# Altium project SAMA7_EVK.PrjPcb (part 3 of 5)

## Sheet 08 - ETH1-100.SchDoc
size B; CompanyName: Microchip Technology Inc.; Organization: Microchip Technology; Address1: 2355 West Chandler Blvd.; Address2: Chandler, AZ  85224; Address4: USA; SheetNumber: 9; SheetTotal: 15; SheetTitle: ETH1-100; Time: Time
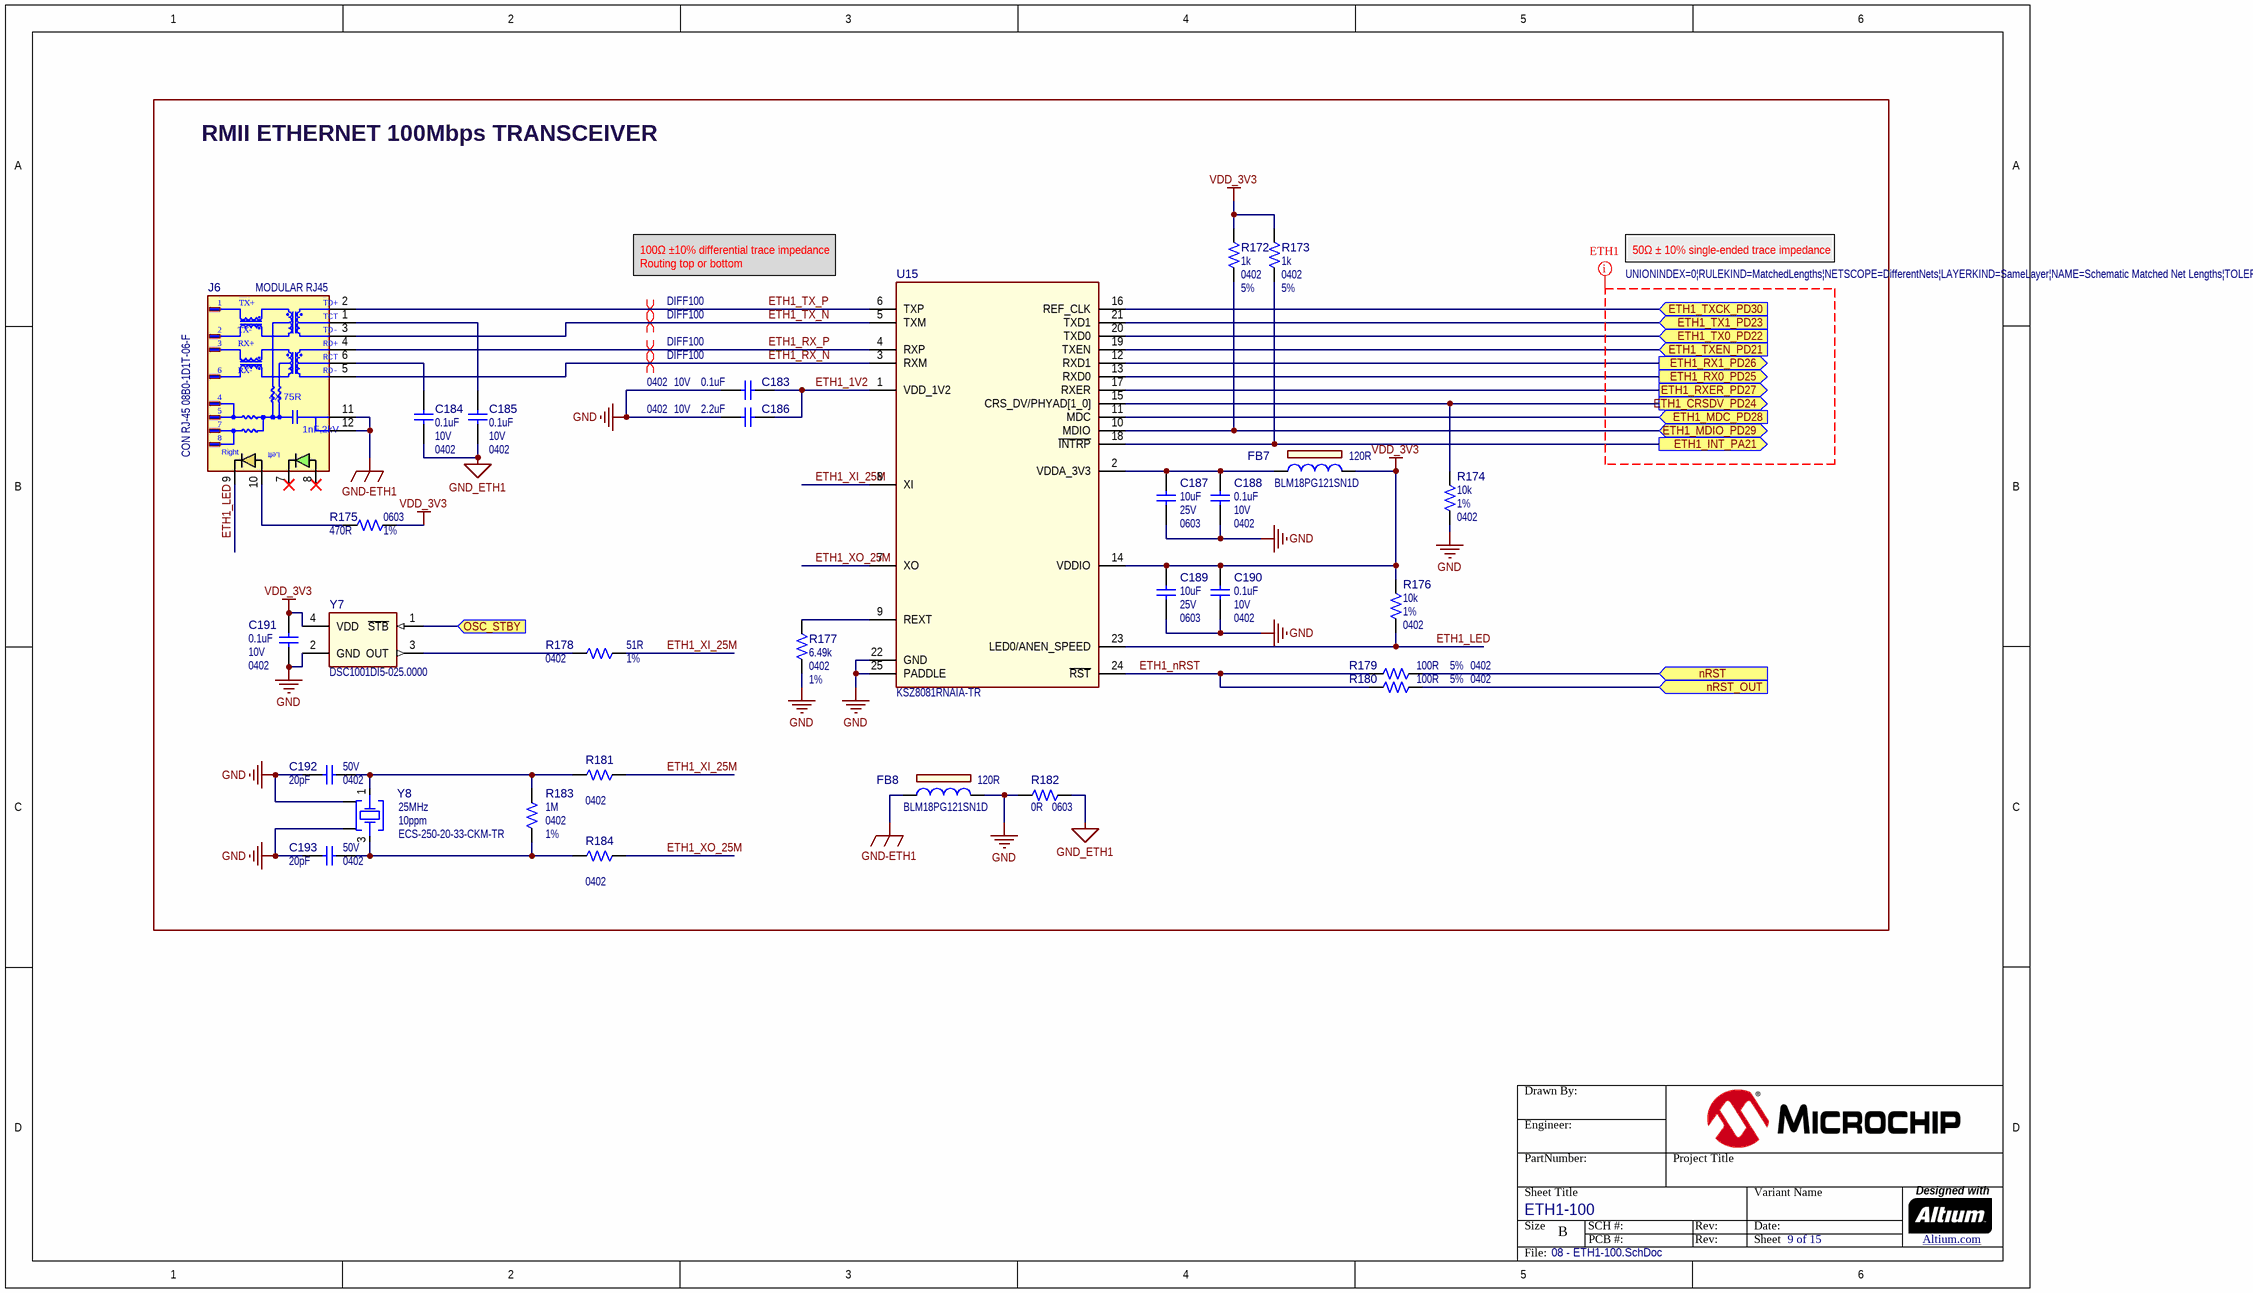
[diagram p4: 08 - ETH1-100.SchDoc]

### Parts
(Parts that share a designator on the sheet are numbered #1, #2 ... from top to bottom, then left to right.)
?#5  (no value)  (graphical)
C183  value 0.1uF  Voltage: 10V  Package: 0402  [CAP_C_0402]  (hidden comment: Capacitor NP)
C184  value 0.1uF  Voltage: 10V  Package: 0402  [CAP_C_0402]  (hidden comment: Capacitor NP)
C185  value 0.1uF  Voltage: 10V  Package: 0402  [CAP_C_0402]  (hidden comment: Capacitor NP)
C186  value 2.2uF  Voltage: 10V  Package: 0402  [CAP_C_0402]  (hidden comment: Capacitor NP)
C187  value 10uF  Voltage: 25V  Package: 0603  [CAP_C_0603]  (hidden comment: Capacitor NP)
C188  value 0.1uF  Voltage: 10V  Package: 0402  [CAP_C_0402]  (hidden comment: Capacitor NP)
C189  value 10uF  Voltage: 25V  Package: 0603  [CAP_C_0603]  (hidden comment: Capacitor NP)
C190  value 0.1uF  Voltage: 10V  Package: 0402  [CAP_C_0402]  (hidden comment: Capacitor NP)
C191  value 0.1uF  Voltage: 10V  Package: 0402  [CAP_C_0402]  (hidden comment: Capacitor NP)
C192  value 20pF  Voltage: 50V  Package: 0402  [CAP_C_0402]  (hidden comment: Capacitor NP)
C193  value 20pF  Voltage: 50V  Package: 0402  [CAP_C_0402]  (hidden comment: Capacitor NP)
FB7  value 120R  Manufacturer Part Number 1: BLM18PG121SN1D  [IND_C_0603]  (hidden comment: Ferrite Bead)
FB8  value 120R  Manufacturer Part Number 1: BLM18PG121SN1D  [IND_C_0603]  (hidden comment: Ferrite Bead)
J6  CON RJ-45 08B0-1D1T-06-F  value MODULAR RJ45  [CON_JACK_RJ45_RA_08B0-1D1T-06-F]
R172  value 1k  Package: 0402  Tolerance: 5%  [RES_C_0402]  (hidden comment: Resistor)
R173  value 1k  Package: 0402  Tolerance: 5%  [RES_C_0402]  (hidden comment: Resistor)
R174  value 10k  Package: 0402  Tolerance: 1%  [RES_C_0402]  (hidden comment: Resistor)
R175  value 470R  Package: 0603  Tolerance: 1%  [RES_C_0603]  (hidden comment: Resistor)
R176  value 10k  Package: 0402  Tolerance: 1%  [RES_C_0402]  (hidden comment: Resistor)
R177  value 6.49k  Package: 0402  Tolerance: 1%  [RES_C_0402]  (hidden comment: Resistor)
R178  value 51R  Package: 0402  Tolerance: 1%  [RES_C_0402]  (hidden comment: Resistor)
R179  value 100R  Package: 0402  Tolerance: 5%  [RES_C_0402]  (hidden comment: Resistor)
R180  value 100R  Package: 0402  Tolerance: 5%  [RES_C_0402]  (hidden comment: Resistor)
R181  Package: 0402  [RES_C_0402]  (hidden comment: Resistor)
R182  value 0R  Package: 0603  [RES_C_0603]  (hidden comment: Resistor)
R183  value 1M  Package: 0402  Tolerance: 1%  [RES_C_0402]  (hidden comment: Resistor)
R184  Package: 0402  [RES_C_0402]  (hidden comment: Resistor)
U15  value KSZ8081RNAIA-TR  [QFN-24_4X4]  (hidden comment: ETHERNET QFN-24)
Y7  Manufacturer Part Number 1: DSC1001DI5-025.0000  [DFN-4_2.5x2]  (hidden comment: DSC10xx DFN-4)
Y8  value 25MHz  Tolerance: 10ppm  Manufacturer Part Number 1: ECS-250-20-33-CKM-TR  [CRYSTAL_L3.2W2.5H0.8]  (hidden comment: Crystal 4 pins 1-3)

### Blocks framed on the sheet
RMII ETHERNET 100Mbps TRANSCEIVER: C183-C193 FB7 FB8 J6 R172-R184 U15 Y7 Y8

### Ports
ETH1_CRSDV_PD24 (out), ETH1_INT_PA21 (out), ETH1_MDC_PD28 (in), ETH1_MDIO_PD29 (bidir), ETH1_RX0_PD25 (out), ETH1_RX1_PD26 (out), ETH1_RXER_PD27 (out), ETH1_TX0_PD22 (in), ETH1_TX1_PD23 (in), ETH1_TXCK_PD30 (in), ETH1_TXEN_PD21 (in), nRST (in), nRST_OUT (in), OSC_STBY (in)

### Nets
GND: C183.1 C186.1 C187.2 C188.1 C189.2 C190.1 C191.1 C192.2 C193.2 FB8.2 R174.1 R177.1 R182.1 U15.22(GND) U15.25(PADDLE) Y7.2(GND) Y8.2 Y8.4
GND-ETH1: FB8.1 J6.11(SHLD) J6.12(SHLD)
GND_ETH1: C184.1 C185.1 R182.2
VDD_3V3: C189.1 C190.2 C191.2 FB7.2 R172.2 R173.2 R175.1 R176.2 U15.14(VDDIO) Y7.4(VDD)
ETH1_1V2: C183.2 C186.2 U15.1(VDD_1V2)
ETH1_LED: J6.9(Ag) R176.1 U15.23(LED0/ANEN_SPEED)
ETH1_nRST: R179.1 R180.1 U15.24(~{RST})
ETH1_RX_N: J6.5(RD-) U15.3(RXM)
ETH1_RX_P: J6.4(RD+) U15.4(RXP)
ETH1_TX_N: J6.3(TD-) U15.5(TXM)
ETH1_TX_P: J6.2(TD+) U15.6(TXP)
ETH1_XI_25M: R178.2 R181.2 U15.8(XI)
ETH1_XO_25M: R184.2 U15.7(XO)
NetC184_2: C184.2 J6.6(RCT)
NetC185_2: C185.2 J6.1(TCT)
NetC187_1: C187.1 C188.2 FB7.1 U15.2(VDDA_3V3)
NetC192_1: C192.1 R181.1 R183.2 Y8.1
NetC193_1: C193.1 R183.1 R184.1 Y8.3
NetJ6_10: J6.10(Cg) R175.2
NetQ3_3: Y7.1(~{STB}) ; port OSC_STBY
NetR4_1: R179.2 ; port nRST
NetR24_1: R180.2 ; port nRST_OUT
NetR172_1: R172.1 U15.10(MDIO) ; port ETH1_MDIO_PD29
NetR173_1: R173.1 U15.18(~{INTRP}) ; port ETH1_INT_PA21
NetR174_2: R174.2 U15.15(CRS_DV/PHYAD[1_0]) ; port ETH1_CRSDV_PD24
NetR177_2: R177.2 U15.9(REXT)
NetR178_1: R178.1 Y7.3(OUT)
NetU15_11: U15.11(MDC) ; port ETH1_MDC_PD28
NetU15_12: U15.12(RXD1) ; port ETH1_RX1_PD26
NetU15_13: U15.13(RXD0) ; port ETH1_RX0_PD25
NetU15_16: U15.16(REF_CLK) ; port ETH1_TXCK_PD30
NetU15_17: U15.17(RXER) ; port ETH1_RXER_PD27
NetU15_19: U15.19(TXEN) ; port ETH1_TXEN_PD21
NetU15_20: U15.20(TXD0) ; port ETH1_TX0_PD22
NetU15_21: U15.21(TXD1) ; port ETH1_TX1_PD23

Not connected (* = marked no-connect by the designer): J6 7(Cy)* 8(Ay)*

### Layout directives
net class ETH1; rule Matched Net Lengths [Tolerance = 0.25mm]: (no net found under the mark)
differential pair; differential pair class DIFF100; net class DIFF100; rule Matched Net Lengths [Tolerance = 4mil]: ETH1_RX_N, ETH1_RX_P, ETH1_TX_N, ETH1_TX_P

### Notes on the sheet
- 100Ω ±10% differential trace impedance
  Routing top or bottom
- 50Ω ± 10% single-ended trace impedance
- Drawn By:
- Engineer:
- PartNumber:
- Project Title
- Sheet Title
- Size
- B
- SCH #:
- PCB #:
- Rev:
- Variant Name
- Date:
- Sheet
- Designed with
- Altium.com <http://go.altium.com/MicrochipLandingPage_Evaluation.html>
- File:
- (in symbol CON1709) TX+; TX-; RX+; RX-; 4X 75R; 1nF,2kV; Left; Right

### Library data of the parts
?#5 = Title Block B
C183-C185 C188 C190 C191 = CAP1238: Capacitor; Manufacturer 1: KEMET; Manufacturer Part Number 1: C0402C104K8RACTU; Description_: CAP CER 0.1uF 10V 10% X7R SMD 0402; Dev Tools Status: Production; Tolerance: 10%; Temperature Coeffcient: X7R; Type: Ceramic; Owner: Tad Ahlvers; Populated: YES; MCHP-ID: CAP1238; Revision: 1; Symbol: Capacitor NP; Status: MCL Design; ComponentLink1URL: https://chn-vm-apps.microchip.com/mchprepo/parts/Datasheets/KEM_C1002_X7R_SMD.pdf; ComponentLink1Description: SVN Datasheet; ComponentLink2URL: C:\ALTIUM_WORK\00001_MCHP-CDB\Datasheets\KEM_C1002_X7R_SMD.pdf; ComponentLink2Description: Local Datasheet; ComponentLink3URL: C:\ALTIUM_WORK\00001_MCHP-CDB\Library\LibraryRefs\Capacitor NP.SchLib; ComponentLink3Description: Open Symbol; ComponentLink4URL: C:\ALTIUM_WORK\00001_MCHP-CDB\Library\Footprints\CAP_C_0402.PcbLib; ComponentLink4Description: Open Footprint; ComponentLink5Description: Open Footprint 2; ComponentLink6Description: Open Footprint 3; ComponentLink7Description: Open Footprint 4; Operating Temperature: -55C to +125C; Category: Capacitor; Manufacturer 2: Samsung; Manufacturer Part Number 2: CL05B104KP5NNNC; Manufacturer 3: Murata Electronics; Manufacturer Part Number 3: GRM155R71A104KA01D; Supplier 1: Digi-Key; Supplier Part Number 1: 399-3520-2-ND; Supplier 2: Digi-Key; Supplier Part Number 2: 1276-1002-2-ND; Supplier 3: Mouser; Supplier Part Number 3: 81-GRM155R71A104KA1D; Quantity Override: 1
C186 = CAP1468: Capacitor; Manufacturer 1: TDK Corporation; Manufacturer Part Number 1: C1005X7S1A225K050BC; Description_: CAP CER 2.2uF 10V 10% X7S SMD 0402; Dev Tools Status: Production; Tolerance: 10%; Temperature Coeffcient: X7S; Type: Ceramic; Owner: Sorin Stanoaia; Populated: YES; MCHP-ID: CAP1468; Revision: 1; Symbol: Capacitor NP; Status: MCL Design; ComponentLink1URL: https://chn-vm-apps.microchip.com/mchprepo/parts/Datasheets/c02e.pdf; ComponentLink1Description: SVN Datasheet; ComponentLink2URL: C:\ALTIUM_WORK\00001_MCHP-CDB\Datasheets\c02e.pdf; ComponentLink2Description: Local Datasheet; ComponentLink3URL: C:\ALTIUM_WORK\00001_MCHP-CDB\Library\LibraryRefs\Capacitor NP.SchLib; ComponentLink3Description: Open Symbol; ComponentLink4URL: C:\ALTIUM_WORK\00001_MCHP-CDB\Library\Footprints\CAP_C_0402.PcbLib; ComponentLink4Description: Open Footprint; ComponentLink5Description: Open Footprint 2; ComponentLink6Description: Open Footprint 3; ComponentLink7Description: Open Footprint 4; Operating Temperature: -55C to +125C; Category: Capacitor; Manufacturer 2: Murata Electronics North America; Manufacturer Part Number 2: GRM155C71A225KE11J; Supplier 1: Digi-Key; Supplier Part Number 1: 445-9097-1-ND; Supplier 2: Digi-Key; Supplier Part Number 2: GRM155C71A225KE11J-ND; Quantity Override: 1
C187 C189 = CAP1650: Capacitor; Manufacturer 1: TDK Corporation; Manufacturer Part Number 1: C1608X5R1E106M080AC; Description_: CAP CER 10uF 25V 20% X5R SMD 0603; Dev Tools Status: Production; Tolerance: 20%; Temperature Coeffcient: X5R; Type: Ceramic; Populated: YES; Owner: Razvan Cristescu; MCHP-ID: CAP1650; Revision: 1; Symbol: Capacitor NP; Status: MCL Design; ComponentLink1URL: https://chn-vm-apps.microchip.com/mchprepo/parts/Datasheets/1913358.pdf; ComponentLink1Description: SVN Datasheet; ComponentLink2URL: C:\ALTIUM_WORK\00001_MCHP-CDB\Datasheets\1913358.pdf; ComponentLink2Description: Local Datasheet; ComponentLink3URL: C:\ALTIUM_WORK\00001_MCHP-CDB\Library\LibraryRefs\Capacitor NP.SchLib; ComponentLink3Description: Open Symbol; ComponentLink4URL: C:\ALTIUM_WORK\00001_MCHP-CDB\Library\Footprints\CAP_C_0603.PcbLib; ComponentLink4Description: Open Footprint; ComponentLink5Description: Open Footprint 2; ComponentLink6Description: Open Footprint 3; ComponentLink7Description: Open Footprint 4; Operating Temperature: -55C to +85C; Category: Capacitor; Supplier 1: Farnell; Supplier Part Number 1: 2521968; Quantity Override: 1
C192 C193 = CAP2438: Manufacturer 1: Samsung Electro-Mechanics; Manufacturer Part Number 1: CL05C200GB51PNC; Description_: Ceramic capacitor, SMD 0402, 20pF, C0G, 50V, +/-2%; Dev Tools Status: Design; Tolerance: 2%; Temperature Coeffcient: C0G; Type: Ceramic; Populated: DNP; Owner: Dragos Danaila; MCHP-ID: CAP2438; Revision: 1; Symbol: Capacitor NP; Status: MCL Design; ComponentLink1Description: SVN Datasheet; ComponentLink2Description: Local Datasheet; ComponentLink3URL: C:\ALTIUM_WORK\00001_MCHP-CDB\Library\LibraryRefs\Capacitor NP.SchLib; ComponentLink3Description: Open Symbol; ComponentLink4URL: C:\ALTIUM_WORK\00001_MCHP-CDB\Library\Footprints\CAP_C_0402.PcbLib; ComponentLink4Description: Open Footprint; ComponentLink5Description: Open Footprint 2; ComponentLink6Description: Open Footprint 3; ComponentLink7Description: Open Footprint 4; Operating Temperature: -55C to +125C; Category: Capacitor; Supplier 1: Digikey; Supplier Part Number 1: 1276-CL05C200GB51PNCTR-ND; Quantity Override: 1
FB7 FB8 = IND1009: Manufacturer 1: Murata; Description_: FERRITE 120R@100MHz 2A SMD 0603; Dev Tools Status: Production; Owner: Petnarong Chaijaroong; DCR: 0.05R; Saturation Current: 12A; Populated: Yes; MCHP-ID: IND1009; Revision: 0; Symbol: Ferrite Bead; Status: MCL Design; ComponentLink1URL: https://chn-vm-apps.microchip.com/mchprepo/parts/Datasheets/L0110S0100BLM18P.pdf; ComponentLink1Description: SVN Datasheet; ComponentLink2URL: C:\ALTIUM_WORK\00001_MCHP-CDB\Datasheets\L0110S0100BLM18P.pdf; ComponentLink2Description: Local Datasheet; ComponentLink3URL: C:\ALTIUM_WORK\00001_MCHP-CDB\Library\LibraryRefs\Ferrite Bead.SchLib; ComponentLink3Description: Open Symbol; ComponentLink4URL: C:\ALTIUM_WORK\00001_MCHP-CDB\Library\Footprints\IND_C_0603.PcbLib; ComponentLink4Description: Open Footprint; ComponentLink5Description: Open Footprint 2; ComponentLink6Description: Open Footprint 3; ComponentLink7Description: Open Footprint 4; Operating Temperature: -55C to +125C; Package: 0603; Type: Ferrite Bead; Category: Inductor; Supplier 1: Digi-Key; Supplier Part Number 1: 490-1037-1-ND; Quantity Override: 1
J6 = CON1709: 100 Base-TX (Fast Ethernet), RJ45 1x1 Tab-UP with LEDs(g/y), integrated magnetics connector; Manufacturer 1: Bel Fuse Inc.; Description_: CON MODULAR JACK RJ45 10/100 MAGNETICS 2xLEDs SHIELD TH R/A; Dev Tools Status: Design; Owner: Ilie Galan; Populated: YES; MCHP-ID: CON1709; Revision: A; Symbol: CON RJ-45 08B0-1D1T-06-F; Status: MCL Design; ComponentLink1URL: https://chn-vm-apps.microchip.com/mchprepo/parts/Datasheets/08B0-1D1T-06-F.pdf; ComponentLink1Description: SVN Datasheet; ComponentLink2URL: C:\ALTIUM_WORK\00001_MCHP-CDB\Datasheets\08B0-1D1T-06-F.pdf; ComponentLink2Description: Local Datasheet; ComponentLink3URL: C:\ALTIUM_WORK\00001_MCHP-CDB\Library\LibraryRefs\CON RJ-45 08B0-1D1T-06-F.SchLib; ComponentLink3Description: Open Symbol; ComponentLink4URL: C:\ALTIUM_WORK\00001_MCHP-CDB\Library\Footprints\CON_JACK_RJ45_RA_08B0-1D1T-06-F.PcbLib; ComponentLink4Description: Open Footprint; ComponentLink5Description: Open Footprint 2; ComponentLink6Description: Open Footprint 3; ComponentLink7Description: Open Footprint 4; Type: Modular; Category: Connector; Manufacturer Part Number 1: 08B0-1D1T-06-F; Supplier 1: Digi-Key; Supplier Part Number 1: 507-1441-ND; Quantity Override: 1
R172 R173 = RSMT0316: Manufacturer 1: Panasonic; Manufacturer Part Number 1: ERJ-2GEJ102X; Description_: RES TKF 1k 5% 1/16W SMD 0402; Dev Tools Status: Production; Voltage: 50V; Temperature Coeffcient: 200ppm/C; Power: 1/16W; Owner: Tad Ahlvers; Populated: YES; MCHP-ID: RSMT0316; Revision: 1; Symbol: Resistor; Status: MCL Design; ComponentLink1URL: https://chn-vm-apps.microchip.com/mchprepo/parts/Datasheets/AOA0000CE1.pdf; ComponentLink1Description: SVN Datasheet; ComponentLink2URL: C:\ALTIUM_WORK\00001_MCHP-CDB\Datasheets\AOA0000CE1.pdf; ComponentLink2Description: Local Datasheet; ComponentLink3URL: C:\ALTIUM_WORK\00001_MCHP-CDB\Library\LibraryRefs\Resistor.SchLib; ComponentLink3Description: Open Symbol; ComponentLink4URL: C:\ALTIUM_WORK\00001_MCHP-CDB\Library\Footprints\RES_C_0402.PcbLib; ComponentLink4Description: Open Footprint; ComponentLink5Description: Open Footprint 2; ComponentLink6Description: Open Footprint 3; ComponentLink7Description: Open Footprint 4; Operating Temperature: -55C to +155C; Category: Resistor; Type: RES SMD; Composition: TKF; Supplier 1: Digi-Key; Supplier Part Number 1: P1.0KJCT-ND; Quantity Override: 1
R174 R176 = RSMT1019: Manufacturer 1: Panasonic; Manufacturer Part Number 1: ERJ-2RKF1002X; Description_: RES TKF 10k 1% 1/10W SMD 0402; Dev Tools Status: Production; Voltage: 50V; Temperature Coeffcient: 100ppm/C; Power: 1/10W; Owner: Brent Lanphear; Populated: Yes; MCHP-ID: RSMT1019; Revision: 2; Symbol: Resistor; Status: MCL Design; ComponentLink1URL: https://chn-vm-apps.microchip.com/mchprepo/parts/Datasheets/AOA0000CE2.pdf; ComponentLink1Description: SVN Datasheet; ComponentLink2URL: C:\ALTIUM_WORK\00001_MCHP-CDB\Datasheets\AOA0000CE2.pdf; ComponentLink2Description: Local Datasheet; ComponentLink3URL: C:\ALTIUM_WORK\00001_MCHP-CDB\Library\LibraryRefs\Resistor.SchLib; ComponentLink3Description: Open Symbol; ComponentLink4URL: C:\ALTIUM_WORK\00001_MCHP-CDB\Library\Footprints\RES_C_0402.PcbLib; ComponentLink4Description: Open Footprint; ComponentLink5Description: Open Footprint 2; ComponentLink6Description: Open Footprint 3; ComponentLink7Description: Open Footprint 4; Operating Temperature: -55C to +155C; Category: Resistor; Type: RES SMD; Composition: TKF; Supplier 1: Digi-Key; Supplier Part Number 1: P10.0KLCT-ND; Quantity Override: 1
R175 = RSMT0518: Manufacturer 1: Panasonic; Manufacturer Part Number 1: ERJ-3EKF4700V; Description_: RES TKF 470R 1% 1/10W SMD 0603; Dev Tools Status: Production; Voltage: 50V; Temperature Coeffcient: 100ppm/C; Power: 1/10W; Populated: Yes; MCHP-ID: RSMT0518; Revision: 1; Symbol: Resistor; Status: MCL Design; ComponentLink1URL: https://chn-vm-apps.microchip.com/mchprepo/parts/Datasheets/PYu-RC0603_51_RoHS_L_4.pdf; ComponentLink1Description: SVN Datasheet; ComponentLink2URL: C:\ALTIUM_WORK\00001_MCHP-CDB\Datasheets\PYu-RC0603_51_RoHS_L_4.pdf; ComponentLink2Description: Local Datasheet; ComponentLink3URL: C:\ALTIUM_WORK\00001_MCHP-CDB\Library\LibraryRefs\Resistor.SchLib; ComponentLink3Description: Open Symbol; ComponentLink4URL: C:\ALTIUM_WORK\00001_MCHP-CDB\Library\Footprints\RES_C_0603.PcbLib; ComponentLink4Description: Open Footprint; ComponentLink5Description: Open Footprint 2; ComponentLink6Description: Open Footprint 3; ComponentLink7Description: Open Footprint 4; Operating Temperature: -55C to +155C; Category: Resistor; Type: RES SMD; Composition: TKF; Manufacturer 2: Stackpole Electronics Inc; Manufacturer Part Number 2: RMCF0603FT470R; Manufacturer 3: Yageo; Manufacturer Part Number 3: RC0603FR-07470RL; Supplier 1: Digi-Key; Supplier Part Number 1: P470HCT-ND; Supplier 2: Digi-Key; Supplier Part Number 2: RMCF1/16470FRTR-ND; Supplier 3: Digi-Key; Supplier Part Number 3: 311-470HRCT-ND; Quantity Override: 1
R177 = RSMT1297: Manufacturer 1: Bourns Inc.; Manufacturer Part Number 1: CR0402-FX-6491GLF; Description_: RES TKF 6.49k 1% 1/16W SMD 0402; Dev Tools Status: Design; Voltage: 50V; Temperature Coeffcient: 100ppm/C; Power: 1/16W; Owner: Dragos Danaila; Populated: YES; MCHP-ID: RSMT1297; Revision: 1; Symbol: Resistor; Status: MCL Design; ComponentLink1URL: https://chn-vm-apps.microchip.com/mchprepo/parts/Datasheets/crxxxxx.pdf; ComponentLink1Description: SVN Datasheet; ComponentLink2URL: C:\ALTIUM_WORK\00001_MCHP-CDB\Datasheets\crxxxxx.pdf; ComponentLink2Description: Local Datasheet; ComponentLink3URL: C:\ALTIUM_WORK\00001_MCHP-CDB\Library\LibraryRefs\Resistor.SchLib; ComponentLink3Description: Open Symbol; ComponentLink4URL: C:\ALTIUM_WORK\00001_MCHP-CDB\Library\Footprints\RES_C_0402.PcbLib; ComponentLink4Description: Open Footprint; ComponentLink5Description: Open Footprint 2; ComponentLink6Description: Open Footprint 3; ComponentLink7Description: Open Footprint 4; Operating Temperature: -55C to +155C; Category: Resistor; Type: RES SMD; Composition: TKF; Supplier 1: Digikey; Supplier Part Number 1: CR0402-FX-6491GLFCT-ND; Quantity Override: 1
R178 = RSMT1294: Manufacturer 1: Panasonic Electronic Components; Manufacturer Part Number 1: ERJ-PA2F51R0X; Description_: RES TKF 51R 1% 1/5W SMD 0402; Dev Tools Status: Design; Voltage: 50V; Temperature Coeffcient: 100ppm/C; Power: 1/5W; Owner: Dragos Danaila; Populated: YES; MCHP-ID: RSMT1294; Revision: 1; Symbol: Resistor; Status: MCL Design; ComponentLink1URL: https://chn-vm-apps.microchip.com/mchprepo/parts/Datasheets/AOA0000C331.pdf; ComponentLink1Description: SVN Datasheet; ComponentLink2URL: C:\ALTIUM_WORK\00001_MCHP-CDB\Datasheets\AOA0000C331.pdf; ComponentLink2Description: Local Datasheet; ComponentLink3URL: C:\ALTIUM_WORK\00001_MCHP-CDB\Library\LibraryRefs\Resistor.SchLib; ComponentLink3Description: Open Symbol; ComponentLink4URL: C:\ALTIUM_WORK\00001_MCHP-CDB\Library\Footprints\RES_C_0402.PcbLib; ComponentLink4Description: Open Footprint; ComponentLink5Description: Open Footprint 2; ComponentLink6Description: Open Footprint 3; ComponentLink7Description: Open Footprint 4; Operating Temperature: -55C to +155C; Category: Resistor; Type: RES SMD; Composition: TKF; Supplier 1: Digikey; Supplier Part Number 1: P124491CT-ND; Quantity Override: 1
R179 = RES2692: Manufacturer 1: Bourns Inc.; Manufacturer Part Number 1: CR0402AJW-101GAS; Description_: RES TKF 100R 5% 1/10W SMD 0402; Dev Tools Status: Design; Voltage: 50V; Temperature Coeffcient: 200ppm/C; Power: 1/16W; Owner: Dragos Danaila; Populated: DNP; MCHP-ID: RES2692; Revision: 1; Symbol: Resistor; Status: MCL Design; ComponentLink1URL: https://chn-vm-apps.microchip.com/mchprepo/parts/Datasheets/crxxxxa-as.pdf; ComponentLink1Description: SVN Datasheet; ComponentLink2URL: C:\ALTIUM_WORK\00001_MCHP-CDB\Datasheets\crxxxxa-as.pdf; ComponentLink2Description: Local Datasheet; ComponentLink3URL: C:\ALTIUM_WORK\00001_MCHP-CDB\Library\LibraryRefs\Resistor.SchLib; ComponentLink3Description: Open Symbol; ComponentLink4URL: C:\ALTIUM_WORK\00001_MCHP-CDB\Library\Footprints\RES_C_0402.PcbLib; ComponentLink4Description: Open Footprint; ComponentLink5Description: Open Footprint 2; ComponentLink6Description: Open Footprint 3; ComponentLink7Description: Open Footprint 4; Operating Temperature: -55C to +155C; Category: Resistor; Type: RES SMD; Composition: TKF; Supplier 1: Digikey; Supplier Part Number 1: CR0402AJW-101GASTR-ND; Quantity Override: 1
R180 = RES2692: Manufacturer 1: Bourns Inc.; Manufacturer Part Number 1: CR0402AJW-101GAS; Description_: RES TKF 100R 5% 1/10W SMD 0402; Dev Tools Status: Design; Voltage: 50V; Temperature Coeffcient: 200ppm/C; Power: 1/16W; Owner: Dragos Danaila; Populated: YES; MCHP-ID: RES2692; Revision: 1; Symbol: Resistor; Status: MCL Design; ComponentLink1URL: https://chn-vm-apps.microchip.com/mchprepo/parts/Datasheets/crxxxxa-as.pdf; ComponentLink1Description: SVN Datasheet; ComponentLink2URL: C:\ALTIUM_WORK\00001_MCHP-CDB\Datasheets\crxxxxa-as.pdf; ComponentLink2Description: Local Datasheet; ComponentLink3URL: C:\ALTIUM_WORK\00001_MCHP-CDB\Library\LibraryRefs\Resistor.SchLib; ComponentLink3Description: Open Symbol; ComponentLink4URL: C:\ALTIUM_WORK\00001_MCHP-CDB\Library\Footprints\RES_C_0402.PcbLib; ComponentLink4Description: Open Footprint; ComponentLink5Description: Open Footprint 2; ComponentLink6Description: Open Footprint 3; ComponentLink7Description: Open Footprint 4; Operating Temperature: -55C to +155C; Category: Resistor; Type: RES SMD; Composition: TKF; Supplier 1: Digikey; Supplier Part Number 1: CR0402AJW-101GASTR-ND; Quantity Override: 1
R181 R184 = RES2693: Manufacturer 1: Bourns Inc.; Manufacturer Part Number 1: CR0402-J/-000GLF; Description_: RES TKF 0R 1/16W SMD 0402; Dev Tools Status: Design; Power: 1/16W; Populated: DNP; Owner: Dragos Danaila; Voltage: 50V; Temperature Coeffcient: 100ppm/C; Current: 1A; MCHP-ID: RES2693; Revision: 1; Symbol: Resistor; Status: MCL Design; ComponentLink1URL: https://chn-vm-apps.microchip.com/mchprepo/parts/Datasheets/crxxxxx.pdf; ComponentLink1Description: SVN Datasheet; ComponentLink2URL: C:\ALTIUM_WORK\00001_MCHP-CDB\Datasheets\crxxxxx.pdf; ComponentLink2Description: Local Datasheet; ComponentLink3URL: C:\ALTIUM_WORK\00001_MCHP-CDB\Library\LibraryRefs\Resistor.SchLib; ComponentLink3Description: Open Symbol; ComponentLink4URL: C:\ALTIUM_WORK\00001_MCHP-CDB\Library\Footprints\RES_C_0402.PcbLib; ComponentLink4Description: Open Footprint; ComponentLink5Description: Open Footprint 2; ComponentLink6Description: Open Footprint 3; ComponentLink7Description: Open Footprint 4; Operating Temperature: -55C to +155C; Category: Resistor; Type: RES SMD; Composition: TKF; Supplier 1: Digikey; Supplier Part Number 1: CR0402-J/-000GLFTR-ND; Quantity Override: 1
R182 = RSMT0001: Manufacturer 1: Panasonic; Manufacturer Part Number 1: ERJ-3GSY0R00V; Description_: RES TKF 0R 1/10W SMD 0603; Dev Tools Status: Production; Power: 1/10W; Populated: Yes; MCHP-ID: RSMT0001; Revision: 2; Symbol: Resistor; Status: MCL Design; ComponentLink1URL: https://chn-vm-apps.microchip.com/mchprepo/parts/Datasheets/nrc.pdf; ComponentLink1Description: SVN Datasheet; ComponentLink2URL: C:\ALTIUM_WORK\00001_MCHP-CDB\Datasheets\nrc.pdf; ComponentLink2Description: Local Datasheet; ComponentLink3URL: C:\ALTIUM_WORK\00001_MCHP-CDB\Library\LibraryRefs\Resistor.SchLib; ComponentLink3Description: Open Symbol; ComponentLink4URL: C:\ALTIUM_WORK\00001_MCHP-CDB\Library\Footprints\RES_C_0603.PcbLib; ComponentLink4Description: Open Footprint; ComponentLink5Description: Open Footprint 2; ComponentLink6Description: Open Footprint 3; ComponentLink7Description: Open Footprint 4; Operating Temperature: -55C to +155C; Category: Resistor; Type: RES SMD; Composition: TKF; Manufacturer 2: Panasonic; Manufacturer Part Number 2: ERJ-3GEY0R00V; Manufacturer 3: ROHM; Manufacturer Part Number 3: MCR03EZPJ000; Manufacturer 4: Stackpole Electronics Inc; Manufacturer Part Number 4: RMCF0603ZT0R00; Manufacturer 5: Stackpole Electronics Inc; Manufacturer Part Number 5: RMCF 1/16 0 R; Manufacturer 6: Vishay; Manufacturer Part Number 6: CRCW06030000Z0EA; Manufacturer 7: Yageo; Manufacturer Part Number 7: RC0603JR-070RL; Manufacturer 8: KOA Speer; Manufacturer Part Number 8: RK73Z1JTTP; Manufacturer 9: NIC Components; Manufacturer Part Number 9: NRC06Z0TRF; Supplier 1: Digi-Key; Supplier Part Number 1: P0.0GTR-ND; Supplier 2: Digi-Key; Supplier Part Number 2: RHM0.0GCT-ND; Supplier 3: Digi-Key; Supplier Part Number 3: RMCF0603ZT0R00TR-ND; Supplier 4: Digi-Key; Supplier Part Number 4: RMCF0603ZT0R00CT-ND; Supplier 5: Digi-Key; Supplier Part Number 5: RMCF1/160RTR-ND; Supplier 6: Digi-Key; Supplier Part Number 6: 541-0.0GCT-ND; Supplier 7: Digi-Key; Supplier Part Number 7: 311-0.0GRCT-ND; Supplier 8: KOA Speer; Supplier Part Number 8: RK73Z1JTTP; Supplier 9: NIC Components; Supplier Part Number 9: NRC06Z0TRF; Quantity Override: 1
R183 = RSMT1017: Manufacturer 1: Panasonic; Manufacturer Part Number 1: ERJ-2RKF1004X; Description_: RES TKF 1M 1% 1/10W SMD 0402; Dev Tools Status: Production; Voltage: 50V; Temperature Coeffcient: 100ppm/C; Power: 1/10W; Owner: Brent Lanphear; Populated: DNP; MCHP-ID: RSMT1017; Revision: 2; Symbol: Resistor; Status: MCL Design; ComponentLink1URL: https://chn-vm-apps.microchip.com/mchprepo/parts/Datasheets/AOA0000CE2.pdf; ComponentLink1Description: SVN Datasheet; ComponentLink2URL: C:\ALTIUM_WORK\00001_MCHP-CDB\Datasheets\AOA0000CE2.pdf; ComponentLink2Description: Local Datasheet; ComponentLink3URL: C:\ALTIUM_WORK\00001_MCHP-CDB\Library\LibraryRefs\Resistor.SchLib; ComponentLink3Description: Open Symbol; ComponentLink4URL: C:\ALTIUM_WORK\00001_MCHP-CDB\Library\Footprints\RES_C_0402.PcbLib; ComponentLink4Description: Open Footprint; ComponentLink5Description: Open Footprint 2; ComponentLink6Description: Open Footprint 3; ComponentLink7Description: Open Footprint 4; Operating Temperature: -55C to +155C; Category: Resistor; Type: RES SMD; Composition: TKF; Supplier 1: Digi-Key; Supplier Part Number 1: P1.00MLCT-ND; Quantity Override: 1
U15 = MIC7404: Manufacturer 1: Microchip Technology; Description_: MCHP INTERFACE ETHERNET KSZ8081RNAIA-TR QFN-24; Dev Tools Status: Design; Owner: Ciprian Abramov; Populated: YES; MCHP-ID: MIC7404; Symbol: KSZ8081RNAIA QFN-24; Type: Ethernet; Status: MCL Design; Revision: A; Category: MCHP-Interface; ComponentLink1Description: SVN Datasheet; ComponentLink2Description: Local Datasheet; ComponentLink3URL: C:\ALTIUM_WORK\00001_MCHP-CDB\Library\LibraryRefs\KSZ8081RNAIA QFN-24.SchLib; ComponentLink3Description: Open Symbol; ComponentLink4URL: C:\ALTIUM_WORK\00001_MCHP-CDB\Library\Footprints\QFN-24_4X4.PcbLib; ComponentLink4Description: Open Footprint; ComponentLink5Description: Open Footprint 2; ComponentLink6Description: Open Footprint 3; ComponentLink7Description: Open Footprint 4; Manufacturer Part Number 1: KSZ8081RNAIA-TR; Supplier 1: Digi-Key; Supplier Part Number 1: 576-4174-1-ND; Quantity Override: 1
Y7 = MIC8282: Manufacturer 1: Microchip Technology; Description_: MCHP CLOCK OSCILLATOR SINGLE 25MHz DSC1001DI5-025.0000 DFN-4; Dev Tools Status: Design; Value: 25MHz; Owner: Ciprian Abramov; Populated: YES; MCHP-ID: MIC8282; Revision: A; Symbol: DSC10xx DFN-4; Status: MCL Design; ComponentLink1Description: SVN Datasheet; ComponentLink2Description: Local Datasheet; ComponentLink3URL: C:\ALTIUM_WORK\00001_MCHP-CDB\Library\LibraryRefs\DSC10xx DFN-4.SchLib; ComponentLink3Description: Open Symbol; ComponentLink4URL: C:\ALTIUM_WORK\00001_MCHP-CDB\Library\Footprints\DFN-4_2.5x2.PcbLib; ComponentLink4Description: Open Footprint; ComponentLink5Description: Open Footprint 2; ComponentLink6Description: Open Footprint 3; ComponentLink7Description: Open Footprint 4; Category: MCHP-Clock/Timing; Type: Oscillator; Supplier 1: Digi-Key; Supplier Part Number 1: 576-4982-5-ND; Quantity Override: 1
Y8 = OSC1159: Crystal; Manufacturer 1: ECS Inc.; Description_: CRYSTAL 25MHz 20pF SMD L3.2W2.5H0.8; Dev Tools Status: Design; Owner: Ciprian Abramov; Load Capacitance: 20pF; Populated: DNP; MCHP-ID: OSC1159; Revision: A; Symbol: Crystal 4 pins 1-3; Status: MCL Design; ComponentLink1URL: https://chn-vm-apps.microchip.com/mchprepo/parts/Datasheets/ecx-32.pdf; ComponentLink1Description: SVN Datasheet; ComponentLink2URL: C:\ALTIUM_WORK\00001_MCHP-CDB\Datasheets\ecx-32.pdf; ComponentLink2Description: Local Datasheet; ComponentLink3URL: C:\ALTIUM_WORK\00001_MCHP-CDB\Library\LibraryRefs\Crystal 4 pins 1-3.SchLib; ComponentLink3Description: Open Symbol; ComponentLink4URL: C:\ALTIUM_WORK\00001_MCHP-CDB\Library\Footprints\CRYSTAL_L3.2W2.5H0.8.PcbLib; ComponentLink4Description: Open Footprint; ComponentLink5Description: Open Footprint 2; ComponentLink6Description: Open Footprint 3; ComponentLink7Description: Open Footprint 4; Operating Temperature: -20C to +70C; Package: L3.2W2.5H0.8; Type: Crystal; Category: Crystal/Oscillator; Supplier 1: Digi-Key; Supplier Part Number 1: XC1817CT-ND; Quantity Override: 1

## Sheet 10 - Expansion Connectors.SchDoc
size B; CompanyName: Microchip Technology Inc.; Organization: Microchip Technology; Address1: 2355 West Chandler Blvd.; Address2: Chandler, AZ  85224; Address4: USA; SheetNumber: 11; SheetTotal: 15; SheetTitle: Expansion Connectors; Time: Time
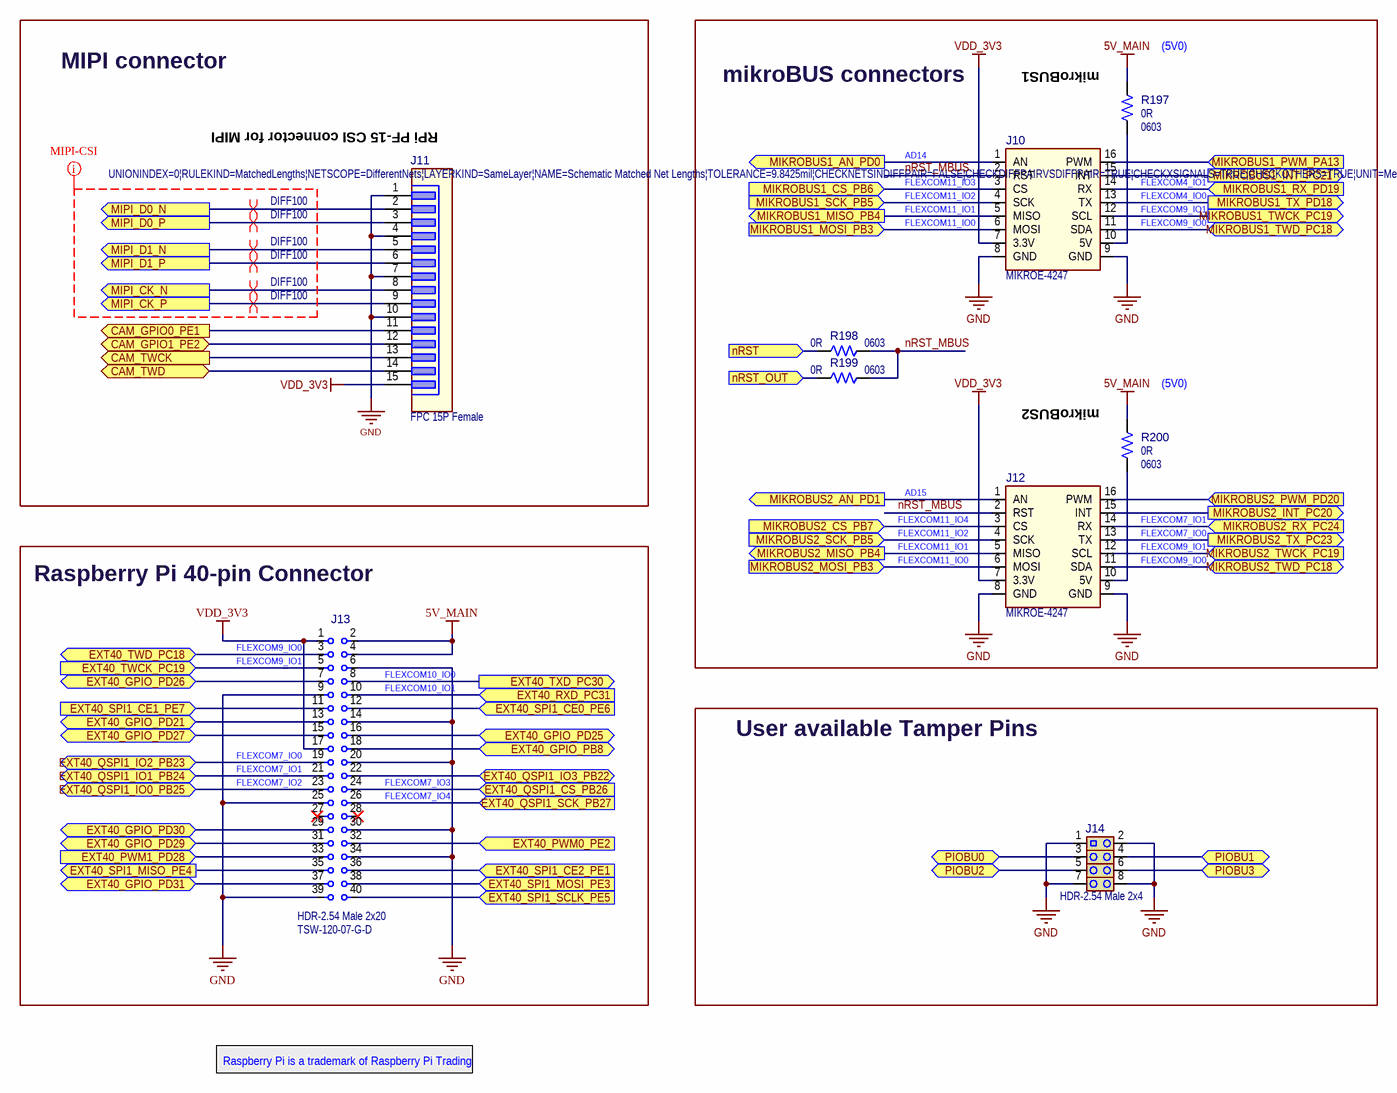
[diagram p5: 10 - Expansion Connectors.SchDoc]

### Parts
(Parts that share a designator on the sheet are numbered #1, #2 ... from top to bottom, then left to right.)
?#6  (no value)  (graphical)
J10  value MIKROE-4247  [SOCKET_mikroBUS_F_2.54_2x8_V_25.4x21_original]  (hidden comment: SOCKET mikroBUS HOST)
J11  value FPC 15P Female  [CON_FPC_1_FEMALE_1X15_SMD_TE_1-1734248-5]  (hidden comment: CON FPC 15pos)
J12  value MIKROE-4247  [SOCKET_mikroBUS_F_2.54_2x8_V_25.4x21_original]  (hidden comment: SOCKET mikroBUS HOST)
J13  value HDR-2.54 Male 2x20  Manufacturer Part Number 1: TSW-120-07-G-D  [HDR_M_2.54_2x20]  (hidden comment: Header 2x20)
J14  value HDR-2.54 Male 2x4  [HDR_M_2.54_2x4_SMD]  (hidden comment: Header 2x4)
R197  value 0R  Package: 0603  [RES_C_0603]  (hidden comment: Resistor)
R198  value 0R  Package: 0603  [RES_C_0603]  (hidden comment: Resistor)
R199  value 0R  Package: 0603  [RES_C_0603]  (hidden comment: Resistor)
R200  value 0R  Package: 0603  [RES_C_0603]  (hidden comment: Resistor)

### Blocks framed on the sheet
MIPI connector: J11
mikroBUS connectors: J10 J12 R197-R200
Raspberry Pi 40-pin Connector: J13
User available Tamper Pins: J14

### Ports
CAM_GPIO0_PE1 (out), CAM_GPIO1_PE2 (bidir), CAM_TWCK (out), CAM_TWD (bidir), EXT40_GPIO_PB8 (bidir), EXT40_GPIO_PD21 (bidir), EXT40_GPIO_PD25 (bidir), EXT40_GPIO_PD26 (bidir), EXT40_GPIO_PD27 (bidir), EXT40_GPIO_PD29 (bidir), EXT40_GPIO_PD30 (bidir), EXT40_GPIO_PD31 (bidir), EXT40_PWM0_PE2 (in), EXT40_PWM1_PD28 (in), EXT40_QSPI1_CS_PB26 (in), EXT40_QSPI1_IO0_PB25 (bidir), EXT40_QSPI1_IO1_PB24 (bidir), EXT40_QSPI1_IO2_PB23 (bidir), EXT40_QSPI1_IO3_PB22 (bidir), EXT40_QSPI1_SCK_PB27 (in), EXT40_RXD_PC31 (in), EXT40_SPI1_CE0_PE6 (in), EXT40_SPI1_CE1_PE7 (in), EXT40_SPI1_CE2_PE1 (in), EXT40_SPI1_MISO_PE4 (out), EXT40_SPI1_MOSI_PE3 (in), EXT40_SPI1_SCLK_PE5 (in), EXT40_TWCK_PC19 (in), EXT40_TWD_PC18 (bidir), EXT40_TXD_PC30 (out), MIKROBUS1_AN_PD0 (out), MIKROBUS1_CS_PB6 (in), MIKROBUS1_INT_PC21 (out), MIKROBUS1_MISO_PB4 (out), MIKROBUS1_MOSI_PB3 (in), MIKROBUS1_PWM_PA13 (in), MIKROBUS1_RX_PD19 (in), MIKROBUS1_SCK_PB5 (in), MIKROBUS1_TWCK_PC19 (out), MIKROBUS1_TWD_PC18 (bidir), MIKROBUS1_TX_PD18 (out), MIKROBUS2_AN_PD1 (out), MIKROBUS2_CS_PB7 (in), MIKROBUS2_INT_PC20 (out), MIKROBUS2_MISO_PB4 (out), MIKROBUS2_MOSI_PB3 (in), MIKROBUS2_PWM_PD20 (in), MIKROBUS2_RX_PC24 (in), MIKROBUS2_SCK_PB5 (in), MIKROBUS2_TWCK_PC19 (in), MIKROBUS2_TWD_PC18 (bidir), MIKROBUS2_TX_PC23 (out), MIPI_CK_N (out), MIPI_CK_P (out), MIPI_D0_N (out), MIPI_D0_P (out), MIPI_D1_N (out), MIPI_D1_P (out), nRST (in), nRST_OUT (in), PIOBU0 (bidir), PIOBU1 (bidir), PIOBU2 (bidir), PIOBU3 (bidir)

### Nets
5V_MAIN: J13.2 J13.4 R197.1 R200.1
GND: J10.8(GND) J10.9(GND) J11.1 J11.4 J11.7 J11.10 J12.8(GND) J12.9(GND) J13.6 J13.9 J13.14 J13.20 J13.25 J13.30 J13.34 J13.39 J14.1 J14.2 J14.7 J14.8
VDD_3V3: J10.7(3.3V) J11.15 J12.7(3.3V) J13.1 J13.17
nRST_MBUS: J10.2(RST) J12.2(RST) R198.2 R199.2
NetJ10_1: J10.1(AN) ; port MIKROBUS1_AN_PD0
NetJ10_3: J10.3(CS) ; port MIKROBUS1_CS_PB6
NetJ10_4: J10.4(SCK) ; port MIKROBUS1_SCK_PB5
NetJ10_5: J10.5(MISO) ; port MIKROBUS1_MISO_PB4
NetJ10_6: J10.6(MOSI) ; port MIKROBUS1_MOSI_PB3
NetJ10_10: J10.10(5V) R197.2
NetJ10_11: J10.11(SDA) ; port MIKROBUS1_TWD_PC18
NetJ10_12: J10.12(SCL) ; port MIKROBUS1_TWCK_PC19
NetJ10_13: J10.13(TX) ; port MIKROBUS1_TX_PD18
NetJ10_14: J10.14(RX) ; port MIKROBUS1_RX_PD19
NetJ10_15: J10.15(INT) ; port MIKROBUS1_INT_PC21
NetJ10_16: J10.16(PWM) ; port MIKROBUS1_PWM_PA13
NetJ11_2: J11.2 ; port MIPI_D0_N
NetJ11_3: J11.3 ; port MIPI_D0_P
NetJ11_5: J11.5 ; port MIPI_D1_N
NetJ11_6: J11.6 ; port MIPI_D1_P
NetJ11_8: J11.8 ; port MIPI_CK_N
NetJ11_9: J11.9 ; port MIPI_CK_P
NetJ11_11: J11.11 ; port CAM_GPIO0_PE1
NetJ11_12: J11.12 ; port CAM_GPIO1_PE2
NetJ11_13: J11.13 ; port CAM_TWCK
NetJ11_14: J11.14 ; port CAM_TWD
NetJ12_1: J12.1(AN) ; port MIKROBUS2_AN_PD1
NetJ12_3: J12.3(CS) ; port MIKROBUS2_CS_PB7
NetJ12_4: J12.4(SCK) ; port MIKROBUS2_SCK_PB5
NetJ12_5: J12.5(MISO) ; port MIKROBUS2_MISO_PB4
NetJ12_6: J12.6(MOSI) ; port MIKROBUS2_MOSI_PB3
NetJ12_10: J12.10(5V) R200.2
NetJ12_11: J12.11(SDA) ; port MIKROBUS2_TWD_PC18
NetJ12_12: J12.12(SCL) ; port MIKROBUS2_TWCK_PC19
NetJ12_13: J12.13(TX) ; port MIKROBUS2_TX_PC23
NetJ12_14: J12.14(RX) ; port MIKROBUS2_RX_PC24
NetJ12_15: J12.15(INT) ; port MIKROBUS2_INT_PC20
NetJ12_16: J12.16(PWM) ; port MIKROBUS2_PWM_PD20
NetJ13_3: J13.3 ; port EXT40_TWD_PC18
NetJ13_5: J13.5 ; port EXT40_TWCK_PC19
NetJ13_7: J13.7 ; port EXT40_GPIO_PD26
NetJ13_8: J13.8 ; port EXT40_TXD_PC30
NetJ13_10: J13.10 ; port EXT40_RXD_PC31
NetJ13_11: J13.11 ; port EXT40_SPI1_CE1_PE7
NetJ13_12: J13.12 ; port EXT40_SPI1_CE0_PE6
NetJ13_13: J13.13 ; port EXT40_GPIO_PD21
NetJ13_15: J13.15 ; port EXT40_GPIO_PD27
NetJ13_16: J13.16 ; port EXT40_GPIO_PD25
NetJ13_18: J13.18 ; port EXT40_GPIO_PB8
NetJ13_19: J13.19 ; port EXT40_QSPI1_IO2_PB23
NetJ13_21: J13.21 ; port EXT40_QSPI1_IO1_PB24
NetJ13_22: J13.22 ; port EXT40_QSPI1_IO3_PB22
NetJ13_23: J13.23 ; port EXT40_QSPI1_IO0_PB25
NetJ13_24: J13.24 ; port EXT40_QSPI1_CS_PB26
NetJ13_26: J13.26 ; port EXT40_QSPI1_SCK_PB27
NetJ13_29: J13.29 ; port EXT40_GPIO_PD30
NetJ13_31: J13.31 ; port EXT40_GPIO_PD29
NetJ13_32: J13.32 ; port EXT40_PWM0_PE2
NetJ13_33: J13.33 ; port EXT40_PWM1_PD28
NetJ13_35: J13.35 ; port EXT40_SPI1_MISO_PE4
NetJ13_36: J13.36 ; port EXT40_SPI1_CE2_PE1
NetJ13_37: J13.37 ; port EXT40_GPIO_PD31
NetJ13_38: J13.38 ; port EXT40_SPI1_MOSI_PE3
NetJ13_40: J13.40 ; port EXT40_SPI1_SCLK_PE5
NetJ14_3: J14.3 ; port PIOBU0
NetJ14_4: J14.4 ; port PIOBU1
NetJ14_5: J14.5 ; port PIOBU2
NetJ14_6: J14.6 ; port PIOBU3
NetR4_1: R198.1 ; port nRST
NetR24_1: R199.1 ; port nRST_OUT

Not connected (* = marked no-connect by the designer): J13 27* 28*

### Layout directives
differential pair; differential pair class DIFF100; net class DIFF100; rule Matched Net Lengths [Tolerance = 4mil]: NetJ11_2, NetJ11_3, NetJ11_5, NetJ11_6, NetJ11_8, NetJ11_9
rule Matched Net Lengths [Tolerance = 0.25mm]; net class MIPI-CSI: (no net found under the mark)

### Notes on the sheet
- (near R197) mikroBUS1
- (near R197) (5V0)
- (near J11) RPi PF-15 CSI connector for MIPI
- AD14
- (near J10) FLEXCOM11_IO3
- (near J10) FLEXCOM11_IO2
- (near J10) FLEXCOM11_IO1
- (near J10) FLEXCOM11_IO0
- FLEXCOM4_IO1
- (near J10) FLEXCOM4_IO0
- (near J10) FLEXCOM9_IO1
- (near J10) FLEXCOM9_IO0
- (near R200) mikroBUS2
- (near R200) (5V0)
- AD15
- (near J12) FLEXCOM11_IO4
- (near J12) FLEXCOM11_IO2
- (near J12) FLEXCOM11_IO1
- (near J12) FLEXCOM11_IO0
- FLEXCOM7_IO1
- (near J12) FLEXCOM7_IO0
- (near J12) FLEXCOM9_IO1
- (near J12) FLEXCOM9_IO0
- (near J13) FLEXCOM9_IO1
- (near J13) FLEXCOM9_IO0
- (near J13) FLEXCOM10_IO0
- (near J13) FLEXCOM10_IO1
- (near J13) FLEXCOM7_IO0
- (near J13) FLEXCOM7_IO1
- (near J13) FLEXCOM7_IO2
- (near J13) FLEXCOM7_IO3
- (near J13) FLEXCOM7_IO4
- Raspberry Pi is a trademark of Raspberry Pi Trading
- Drawn By:
- Engineer:
- PartNumber:
- Project Title
- Sheet Title
- Size
- B
- SCH #:
- PCB #:
- Rev:
- Variant Name
- Date:
- Sheet
- Designed with
- Altium.com <http://go.altium.com/MicrochipLandingPage_Evaluation.html>
- File:

### Library data of the parts
?#6 = Title Block B
J10 J12 = SKT1157: Manufacturer 1: MikroElektronika; Description_: SOCKET mikroBUS HOST DIP 16 TH; Dev Tools Status: Design; Owner: Dragos Danaila; Populated: YES; MCHP-ID: SKT1157; Revision: 2; Symbol: SOCKET mikroBUS HOST; Status: MCL Design; ComponentLink1URL: https://chn-vm-apps.microchip.com/mchprepo/parts/Datasheets/MIKROE-4247.pdf; ComponentLink1Description: SVN Datasheet; ComponentLink2URL: C:\ALTIUM_WORK\00001_MCHP-CDB\Datasheets\MIKROE-4247.pdf; ComponentLink2Description: Local Datasheet; ComponentLink3URL: C:\ALTIUM_WORK\00001_MCHP-CDB\Library\LibraryRefs\SOCKET mikroBUS HOST.SchLib; ComponentLink3Description: Open Symbol; ComponentLink4URL: C:\ALTIUM_WORK\00001_MCHP-CDB\Library\Footprints\SOCKET_mikroBUS_F_2.54_2x8_V_25.4x21_original.PcbLib; ComponentLink4Description: Open Footprint; ComponentLink5Description: Open Footprint 2; ComponentLink6Description: Open Footprint 3; ComponentLink7Description: Open Footprint 4; Type: MikroBUS; Category: Socket; Manufacturer Part Number 1: MIKROE-4247; Manufacturer 2: MikroElektronika; Manufacturer Part Number 2: MIKROE-4247; Supplier 1: TME; Supplier Part Number 1: MIKROE-4247; Supplier 2: TME; Supplier Part Number 2: MIKROE-4247; Quantity Override: 1
J11 = CON1911: Manufacturer 1: TE Connectivity AMP Connectors; Manufacturer Part Number 1: 1-1734248-5; Description_: CON FPC 1mm 15P Female SMD VERT; Dev Tools Status: Design; Owner: Ilie Galan; Voltage: 125V; Populated: YES; MCHP-ID: CON1911; Revision: 1; Symbol: CON FPC 15pos; Status: MCL Design; ComponentLink1URL: https://chn-vm-apps.microchip.com/mchprepo/parts/Datasheets/ENG_CD_1734248_E1__.pdf; ComponentLink1Description: SVN Datasheet; ComponentLink2URL: C:\ALTIUM_WORK\00001_MCHP-CDB\Datasheets\ENG_CD_1734248_E1__.pdf; ComponentLink2Description: Local Datasheet; ComponentLink3URL: C:\ALTIUM_WORK\00001_MCHP-CDB\Library\LibraryRefs\CON FPC 15pos.SchLib; ComponentLink3Description: Open Symbol; ComponentLink4URL: C:\ALTIUM_WORK\00001_MCHP-CDB\Library\Footprints\CON_FPC_1_FEMALE_1X15_SMD_TE_1-1734248-5.PcbLib; ComponentLink4Description: Open Footprint; ComponentLink5Description: Open Footprint 2; ComponentLink6Description: Open Footprint 3; ComponentLink7Description: Open Footprint 4; Type: FFC/FPC; Category: Connector; Supplier 1: Digi-Key; Supplier Part Number 1: A101418CT-ND; Quantity Override: 1
J13 = CON0153: Manufacturer 1: Samtec; Description_: CON HDR-2.54 Male 2x20 Gold 5.84MH TH VERT; Dev Tools Status: Production; Owner: Stephen Humberd; Populated: YES; MCHP-ID: CON0153; Revision: 1; Symbol: Header 2x20; Status: MCL Design; ComponentLink1URL: https://chn-vm-apps.microchip.com/mchprepo/parts/Datasheets/TSW-XXX-XX-XXX-X-XX-XXX-MKT.pdf; ComponentLink1Description: SVN Datasheet; ComponentLink2URL: C:\ALTIUM_WORK\00001_MCHP-CDB\Datasheets\TSW-XXX-XX-XXX-X-XX-XXX-MKT.pdf; ComponentLink2Description: Local Datasheet; ComponentLink3URL: C:\ALTIUM_WORK\00001_MCHP-CDB\Library\LibraryRefs\Header 2x20.SchLib; ComponentLink3Description: Open Symbol; ComponentLink4URL: C:\ALTIUM_WORK\00001_MCHP-CDB\Library\Footprints\HDR_M_2.54_2x20.PcbLib; ComponentLink4Description: Open Footprint; ComponentLink5Description: Open Footprint 2; ComponentLink6Description: Open Footprint 3; ComponentLink7Description: Open Footprint 4; Type: Header 2.54mm; Category: Connector; Manufacturer 2: Samtec; Manufacturer Part Number 2: TSW-120-07-S-D; Supplier 1: Samtec; Supplier Part Number 1: TSW-120-07-G-D; Supplier 2: Samtec; Supplier Part Number 2: TSW-120-07-S-D; Quantity Override: 1
J14 = CON1426: Manufacturer 1: Sullins Connector Solutions; Manufacturer Part Number 1: GBC04DABN-M30; Description_: CON HDR-2.54 Male 2x4 Gold 5.84MH SMT VERT; Dev Tools Status: Design; Owner: Jamus Griego; Populated: DNP; MCHP-ID: CON1426; Revision: B; Symbol: Header 2x4; Status: MCL Design; ComponentLink1URL: https://chn-vm-apps.microchip.com/mchprepo/parts/Datasheets/C10059.pdf; ComponentLink1Description: SVN Datasheet; ComponentLink2URL: C:\ALTIUM_WORK\00001_MCHP-CDB\Datasheets\C10059.pdf; ComponentLink2Description: Local Datasheet; ComponentLink3URL: C:\ALTIUM_WORK\00001_MCHP-CDB\Library\LibraryRefs\Header 2x4.SchLib; ComponentLink3Description: Open Symbol; ComponentLink4URL: C:\ALTIUM_WORK\00001_MCHP-CDB\Library\Footprints\HDR_M_2.54_2x4_SMD.PcbLib; ComponentLink4Description: Open Footprint; ComponentLink5Description: Open Footprint 2; ComponentLink6Description: Open Footprint 3; ComponentLink7Description: Open Footprint 4; Type: Header 2.54mm; Category: Connector; Supplier 1: Digi-Key; Supplier Part Number 1: S2351E-04-ND; Quantity Override: 1
R197 R199 R200 = RSMT0001: Manufacturer 1: Panasonic; Manufacturer Part Number 1: ERJ-3GSY0R00V; Description_: RES TKF 0R 1/10W SMD 0603; Dev Tools Status: Production; Power: 1/10W; Populated: YES; MCHP-ID: RSMT0001; Revision: 2; Symbol: Resistor; Status: MCL Design; ComponentLink1URL: https://chn-vm-apps.microchip.com/mchprepo/parts/Datasheets/nrc.pdf; ComponentLink1Description: SVN Datasheet; ComponentLink2URL: C:\ALTIUM_WORK\00001_MCHP-CDB\Datasheets\nrc.pdf; ComponentLink2Description: Local Datasheet; ComponentLink3URL: C:\ALTIUM_WORK\00001_MCHP-CDB\Library\LibraryRefs\Resistor.SchLib; ComponentLink3Description: Open Symbol; ComponentLink4URL: C:\ALTIUM_WORK\00001_MCHP-CDB\Library\Footprints\RES_C_0603.PcbLib; ComponentLink4Description: Open Footprint; ComponentLink5Description: Open Footprint 2; ComponentLink6Description: Open Footprint 3; ComponentLink7Description: Open Footprint 4; Operating Temperature: -55C to +155C; Category: Resistor; Type: RES SMD; Composition: TKF; Manufacturer 2: Panasonic; Manufacturer Part Number 2: ERJ-3GEY0R00V; Manufacturer 3: ROHM; Manufacturer Part Number 3: MCR03EZPJ000; Manufacturer 4: Stackpole Electronics Inc; Manufacturer Part Number 4: RMCF0603ZT0R00; Manufacturer 5: Stackpole Electronics Inc; Manufacturer Part Number 5: RMCF 1/16 0 R; Manufacturer 6: Vishay; Manufacturer Part Number 6: CRCW06030000Z0EA; Manufacturer 7: Yageo; Manufacturer Part Number 7: RC0603JR-070RL; Manufacturer 8: KOA Speer; Manufacturer Part Number 8: RK73Z1JTTP; Manufacturer 9: NIC Components; Manufacturer Part Number 9: NRC06Z0TRF; Supplier 1: Digi-Key; Supplier Part Number 1: P0.0GTR-ND; Supplier 2: Digi-Key; Supplier Part Number 2: RHM0.0GCT-ND; Supplier 3: Digi-Key; Supplier Part Number 3: RMCF0603ZT0R00TR-ND; Supplier 4: Digi-Key; Supplier Part Number 4: RMCF0603ZT0R00CT-ND; Supplier 5: Digi-Key; Supplier Part Number 5: RMCF1/160RTR-ND; Supplier 6: Digi-Key; Supplier Part Number 6: 541-0.0GCT-ND; Supplier 7: Digi-Key; Supplier Part Number 7: 311-0.0GRCT-ND; Supplier 8: KOA Speer; Supplier Part Number 8: RK73Z1JTTP; Supplier 9: NIC Components; Supplier Part Number 9: NRC06Z0TRF; Quantity Override: 1
R198 = RSMT0001: Manufacturer 1: Panasonic; Manufacturer Part Number 1: ERJ-3GSY0R00V; Description_: RES TKF 0R 1/10W SMD 0603; Dev Tools Status: Production; Power: 1/10W; Populated: DNP; MCHP-ID: RSMT0001; Revision: 2; Symbol: Resistor; Status: MCL Design; ComponentLink1URL: https://chn-vm-apps.microchip.com/mchprepo/parts/Datasheets/nrc.pdf; ComponentLink1Description: SVN Datasheet; ComponentLink2URL: C:\ALTIUM_WORK\00001_MCHP-CDB\Datasheets\nrc.pdf; ComponentLink2Description: Local Datasheet; ComponentLink3URL: C:\ALTIUM_WORK\00001_MCHP-CDB\Library\LibraryRefs\Resistor.SchLib; ComponentLink3Description: Open Symbol; ComponentLink4URL: C:\ALTIUM_WORK\00001_MCHP-CDB\Library\Footprints\RES_C_0603.PcbLib; ComponentLink4Description: Open Footprint; ComponentLink5Description: Open Footprint 2; ComponentLink6Description: Open Footprint 3; ComponentLink7Description: Open Footprint 4; Operating Temperature: -55C to +155C; Category: Resistor; Type: RES SMD; Composition: TKF; Manufacturer 2: Panasonic; Manufacturer Part Number 2: ERJ-3GEY0R00V; Manufacturer 3: ROHM; Manufacturer Part Number 3: MCR03EZPJ000; Manufacturer 4: Stackpole Electronics Inc; Manufacturer Part Number 4: RMCF0603ZT0R00; Manufacturer 5: Stackpole Electronics Inc; Manufacturer Part Number 5: RMCF 1/16 0 R; Manufacturer 6: Vishay; Manufacturer Part Number 6: CRCW06030000Z0EA; Manufacturer 7: Yageo; Manufacturer Part Number 7: RC0603JR-070RL; Manufacturer 8: KOA Speer; Manufacturer Part Number 8: RK73Z1JTTP; Manufacturer 9: NIC Components; Manufacturer Part Number 9: NRC06Z0TRF; Supplier 1: Digi-Key; Supplier Part Number 1: P0.0GTR-ND; Supplier 2: Digi-Key; Supplier Part Number 2: RHM0.0GCT-ND; Supplier 3: Digi-Key; Supplier Part Number 3: RMCF0603ZT0R00TR-ND; Supplier 4: Digi-Key; Supplier Part Number 4: RMCF0603ZT0R00CT-ND; Supplier 5: Digi-Key; Supplier Part Number 5: RMCF1/160RTR-ND; Supplier 6: Digi-Key; Supplier Part Number 6: 541-0.0GCT-ND; Supplier 7: Digi-Key; Supplier Part Number 7: 311-0.0GRCT-ND; Supplier 8: KOA Speer; Supplier Part Number 8: RK73Z1JTTP; Supplier 9: NIC Components; Supplier Part Number 9: NRC06Z0TRF; Quantity Override: 1